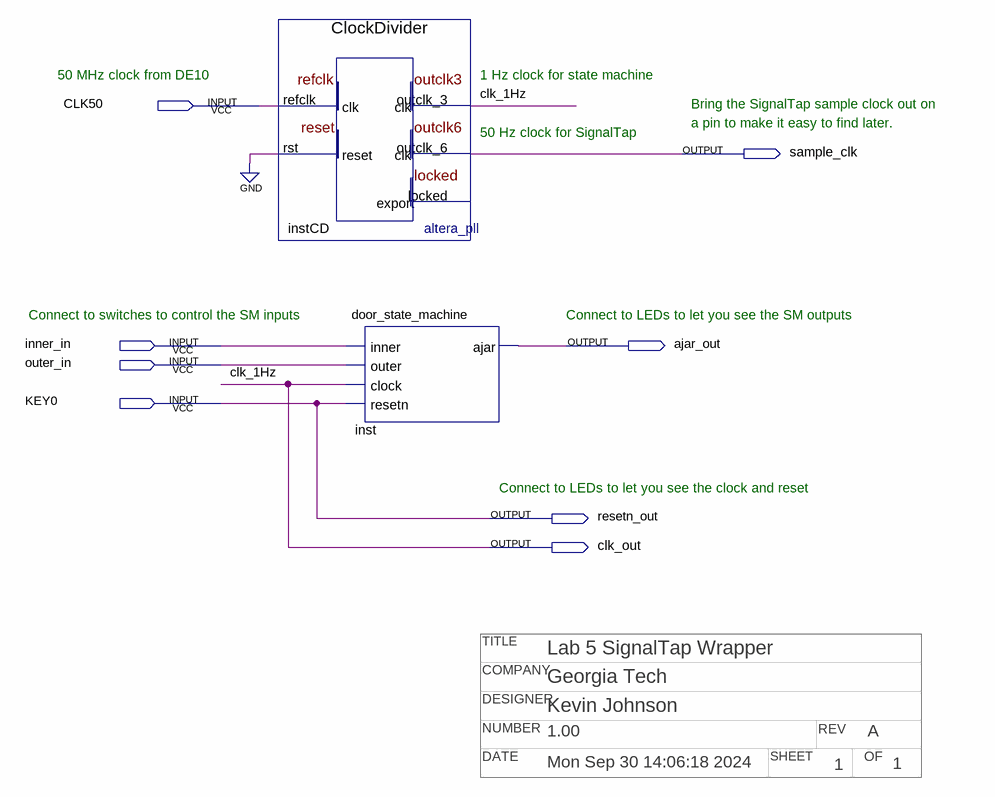
[diagram p0: schematic sheet]
// Quartus schematic Lab5Wrapper.bdf as structural Verilog: 2 symbols, 8 pins
// Title block: COMPANY: Georgia Tech; DATE: Mon Sep 30 14:06:18 2024; DESIGNER: Kevin Johnson; NUMBER: 1.00; OF: 1; REV: A; SHEET: 1; TITLE: Lab 5 SignalTap Wrapper
module Lab5Wrapper (
  input  CLK50,
  input  inner_in,
  input  outer_in,
  input  KEY0,
  output sample_clk,
  output ajar_out,
  output resetn_out,
  output clk_out
);

  ClockDivider instCD (.refclk(CLK50), .rst(1'b0), .outclk_3(clk_out), .outclk_6(sample_clk));  // open: locked
  door_state_machine inst (.inner(inner_in), .outer(outer_in), .clock(clk_out), .resetn(KEY0), .ajar(ajar_out));

  assign resetn_out = KEY0;

  // Other names for the same wires on the sheet: clk_1Hz = clk_out

  // Notes on the sheet:
  //   50 MHz clock from DE10
  //   1 Hz clock for state machine
  //   Bring the SignalTap sample clock out on
  //   a pin to make it easy to find later.
  //   50 Hz clock for SignalTap
  //   Connect to switches to control the SM inputs
  //   Connect to LEDs to let you see the SM outputs
  //   Connect to LEDs to let you see the clock and reset
endmodule
